# Altium schematic sheet 12.SchDoc
size 297 x 209 mm
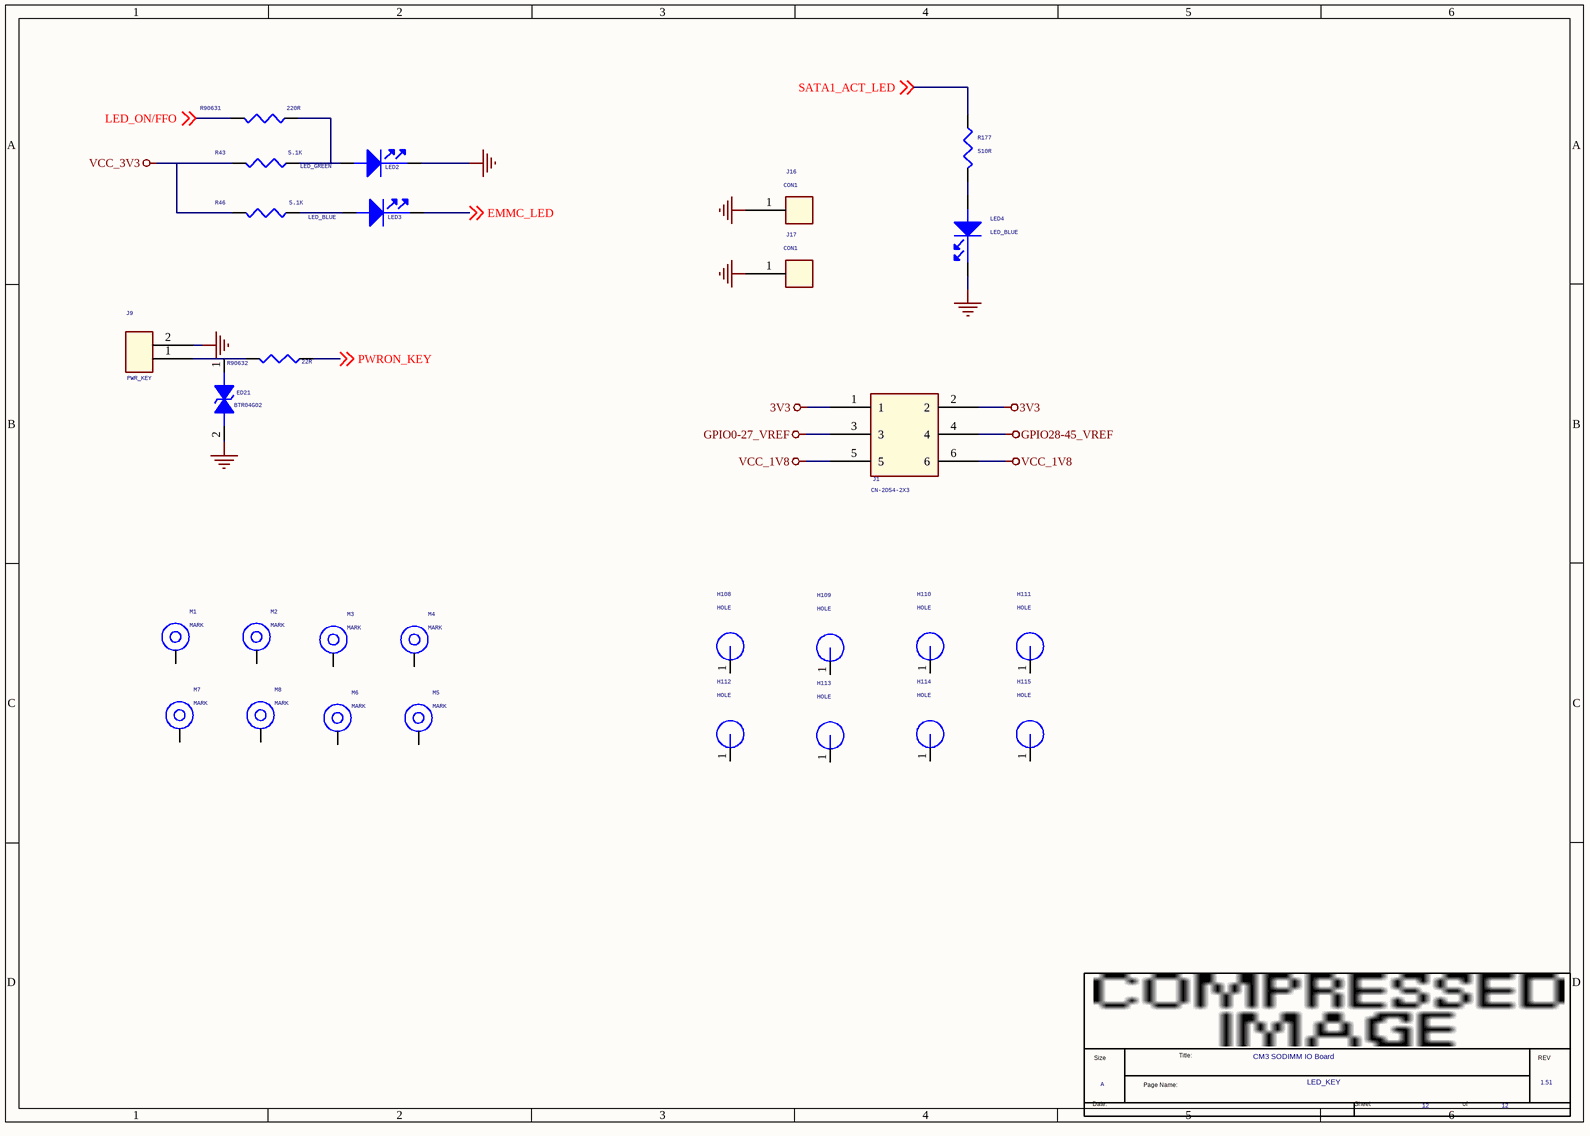
[diagram p0: 12.SchDoc]

## Parts
*  Page Count: 12  Page Size: A  Title: CM3 SODIMM IO Board  RevCode: 1.51  Doc: LED_KEY  (hidden comment: radxa_1010)  (graphical)
ED21  BTR04G02  [ESD0402_1xD5]
H108  HOLE  [H3.8MM]
H109  HOLE  [H3.8MM]
H110  HOLE  [H3.8MM]
H111  HOLE  [H3.8MM]
H112  HOLE  [H3.8MM]
H113  HOLE  [H3.8MM]
H114  HOLE  [H3.8MM]
H115  HOLE  [H3.8MM]
J1  CN-2D54-2X3  [CN-2D54-2X3]
J9  PWR_KEY  [DIP2PIN-2P54MM]
J16  CON1  [DIP_3D5X2D7MM]
J17  CON1  [DIP_3D5X2D7MM]
LED2  LED_GREEN  [LED0603]
LED3  LED_BLUE  [LED0603]
LED4  LED_BLUE  [LED0603]
M1  MARK  [MARK]
M2  MARK  [MARK]
M3  MARK  [MARK]
M4  MARK  [MARK]
M5  MARK  [MARK]
M6  MARK  [MARK]
M7  MARK  [MARK]
M8  MARK  [MARK]
R43  5.1K  [R0402]
R46  5.1K  [R0402]
R177  510R  [R0402]
R90631  220R  [R0402]
R90632  22R  [R0402]

## Nets
3V3: J1.1 J1.2
GND: ED21.2 J9.2 J16.1 J17.1 LED2.2(CATHODE) LED4.2(CATHODE)
GPIO0-27_VREF: J1.3
GPIO28-45_VREF: J1.4
VCC_1V8: J1.5 J1.6
VCC_3V3: R43.1 R46.1
EMMC_LED: LED3.2(CATHODE) ; off-sheet EMMC_LED
LED_ON/FFO: R90631.1 ; off-sheet LED_ON/FFO
PWRON_KEY: R90632.2 ; off-sheet PWRON_KEY
SATA1_ACT_LED: R177.1 ; off-sheet SATA1_ACT_LED
NetED21_1: ED21.1 J9.1 R90632.1
NetLED2_1: LED2.1(ANODE) R43.2 R90631.2
NetLED3_1: LED3.1(ANODE) R46.2
NetLED4_1: LED4.1(ANODE) R177.2

Not connected (* = marked no-connect by the designer): H108 1; H109 1; H110 1; H111 1; H112 1; H113 1; H114 1; H115 1; M1 1; M2 1; M3 1; M4 1; M5 1; M6 1; M7 1; M8 1

## Notes on the sheet
- (in symbol radxa_1010) Size; Title:; REV; Page Name:; Date:; Sheet; of

## Library data of the parts
ED21 = DIODE BI_DIR TRIG: 1-Line, Bi-directional, Transient Voltage Suppressors.17.5pF.; Manufacturer PN: ESD5451N; Manufacturer: WillSemi(韦尔半导体); Priority: A; Created by: JJJ; Part Type: ESD_TVS; RK PN: ESD5451N
H108-H111 = HOLE: 直径3.5mm hole; RK PN: HOLE_3R50; Priority: A; Part Type: HOLE; Created by: CZD
H112-H115 = HOLE: 直径3.5mm hole; Priority: A; RK PN: HOLE_3R50; Created by: CZD; Part Type: HOLE
J1 = CON15_0
J9 = CON2
LED2 = LED: 贴片LED灯，0603，绿色; Priority: A; RK PN: LED_GREEN; Part Type: LED; Created by: JJJ
LED3 = LED: 贴片LED灯，0603，绿色; Priority: A; RK PN: LED_GREEN; Created by: JJJ; Part Type: LED
LED4 = LED: 贴片LED灯，0603，红色; option: SATA2_ACT_LED; RK PN: LED_RED; Priority: A; Part Type: LED; Created by: JJJ
M1 M4 M5 M7 = MARK: MARK Symble; RK PN: MARK01; Priority: A; Part Type: MARK; Created by: JJJ
M2 M3 M6 M8 = MARK: MARK Symble; Priority: A; RK PN: MARK01; Created by: JJJ; Part Type: MARK
R43 R46 R90631 = RESISTOR_2: 通用厚膜电阻,330R,+/-5%,R0402,1/16W.; Manufacturer: YAGEO; Tolerance: 5%; RK PN: RC0402JR-07330RL; Priority: A; Wattage: 1/16W; Part Type: 通用厚膜电阻; Manufacturer PN: RC0402JR-07330RL; Created by: YTL
R177 = RESISTOR_0: 通用厚膜电阻,510R,+/-5%,R0402,1/16W.; Manufacturer: YAGEO; Tolerance: 5%; RK PN: RC0402JR-07510RL; Priority: A; Wattage: 1/16W; Part Type: 通用厚膜电阻; Manufacturer PN: RC0402JR-07510RL; Created by: YTL
R90632 = RESISTOR_0: 通用厚膜电阻,220K,+/-5%,R0402,1/16W.; Manufacturer PN: RC0402JR-07220KL; Manufacturer: YAGEO; Tolerance: 5%; Wattage: 1/16W; Priority: A; Created by: YTL; Part Type: 通用厚膜电阻; RK PN: RC0402JR-07220KL
* = radxa_1010: Page Number: 12; Page Create Date: March  8, 1995